# EAGLE design cc2652p_rf-star (EAGLE 9.6.2)
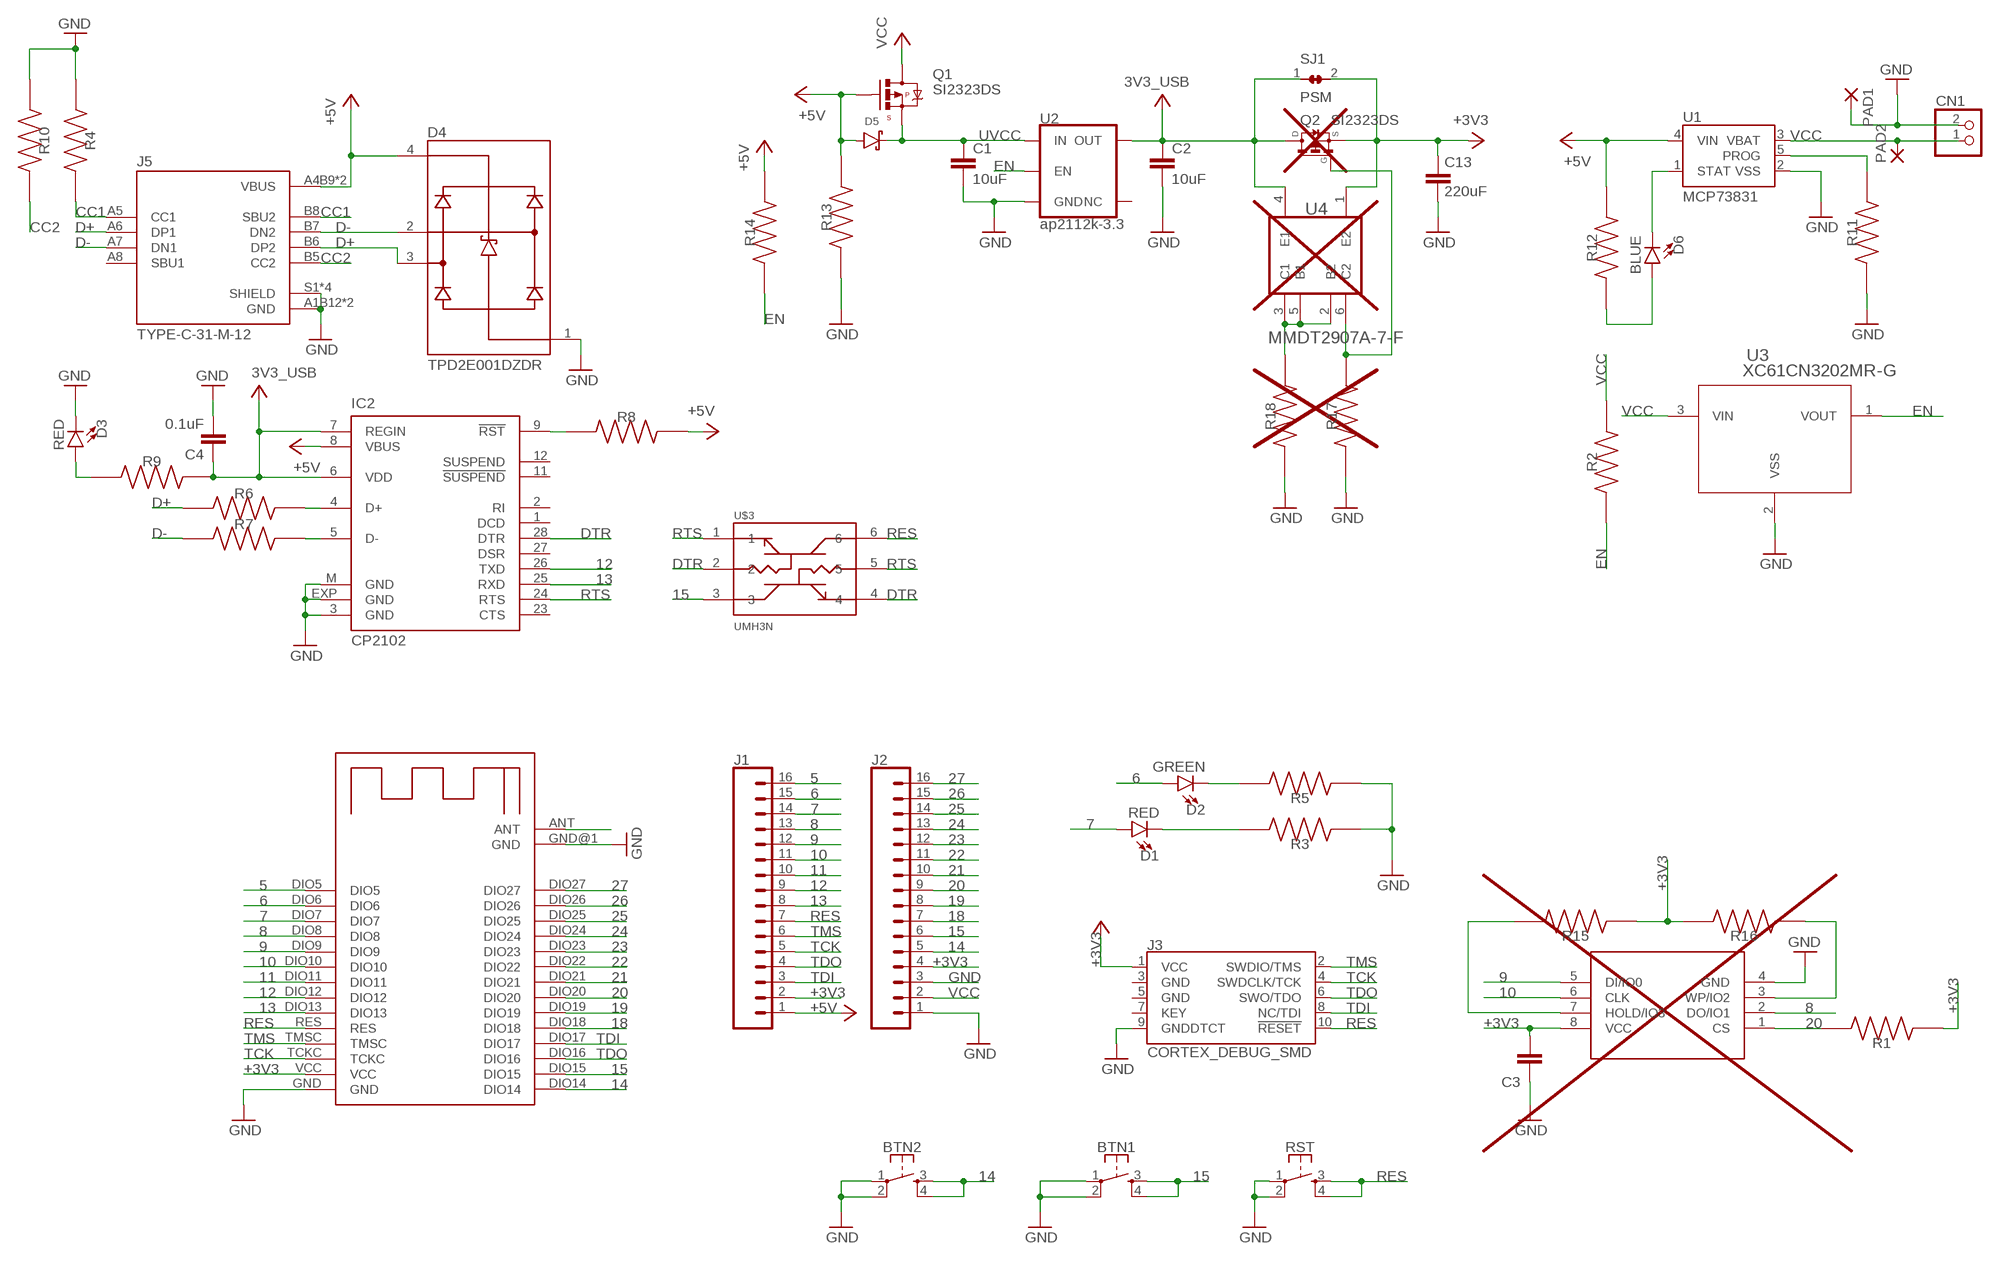
[diagram p0: schematic, sheet 1]

## Parts
BTN1  MOMENTARY-SWITCH-SPST-2-SMD-4.6X2.8MM  [TACTILE_SWITCH_SMD_4.6X2.8MM]
BTN2  MOMENTARY-SWITCH-SPST-2-SMD-4.6X2.8MM  [TACTILE_SWITCH_SMD_4.6X2.8MM]
C1  10uF  10UF-0603-6.3V-20%  [0603]
C2  10uF  10UF-0603-6.3V-20%  [0603]
C3  100n  CAP0402  [CAPC1005X40N]
C4  0.1uF  0.1UF-0603-25V-(+80/-20%)  [0603]
C13  220uF  C_TANTALUM-2917(7343-METRIC)  [CAPM7343X310]
CN1  JST_2PIN-SMT-RA  [JST-PH-2-SMT-RA]
D1  RED  LED-RED0603  [LED-0603]
D2  GREEN  LED-GREEN0603  [LED-0603]
D3  RED  LED-RED0603  [LED-0603]
D4  TPD2E001DZDR  [SOT192P237X122-4N]
D5  DIODE-SCHOTTKY  [SOD-323]
D6  BLUE  LED-BLUE0603  [LED-0603]
IC2  CP2102  [MLP28]
J1  CONN_161X16_NO_SILK  [1X16_NO_SILK]
J2  CONN_161X16_NO_SILK  [1X16_NO_SILK]
J3  CORTEX_DEBUG_SMD  [SAMTECH_FTSH-105-01]
J5  TYPE-C-31-M-12  [HRO_TYPE-C-31-M-12]
PAD1  WIREPADSMD1,27-254  [SMD1,27-2,54]
PAD2  WIREPADSMD1,27-254  [SMD1,27-2,54]
Q1  SI2323DS  MOSFET-PCHANNEL  [SOT23]
Q2  SI2323DS  [SOT23]
R1  2.2k  RC0402FR-073M6L  [RESC1005X40N]
R2  10k  RC0402FR-073M6L  [RESC1005X40N]
R3  2.2k  RC0402FR-073M6L  [RESC1005X40N]
R4  5.1k  RC0402FR-073M6L  [RESC1005X40N]
R5  2.2k  RC0402FR-073M6L  [RESC1005X40N]
R6  33Ohm  RC0402FR-073M6L  [RESC1005X40N]
R7  33Ohm  RC0402FR-073M6L  [RESC1005X40N]
R8  4.7k  RC0402FR-073M6L  [RESC1005X40N]
R9  2.2k  RC0402FR-073M6L  [RESC1005X40N]
R10  5.1k  RC0402FR-073M6L  [RESC1005X40N]
R11  2k  RC0402FR-073M6L  [RESC1005X40N]
R12  2.2k  RC0402FR-073M6L  [RESC1005X40N]
R13  100k  RC0402FR-073M6L  [RESC1005X40N]
R14  10k  RC0402FR-073M6L  [RESC1005X40N]
R15  0  RC0402FR-073M6L  [RESC1005X40N]
R16  0  RC0402FR-073M6L  [RESC1005X40N]
R17  100k  RC0402FR-073M6L  [RESC1005X40N]
R18  100k  RC0402FR-073M6L  [RESC1005X40N]
RST  MOMENTARY-SWITCH-SPST-2-SMD-4.6X2.8MM  [TACTILE_SWITCH_SMD_4.6X2.8MM]
SJ1  PSM  SMALL_SOLDER_JUMPER_CLOSED  [SMALL_SOLDER_JUMPER_CLOSED]
U1  MCP73831  [SOT23-5]
U2  ap2112k-3.3  V_REG_AP2112K-3.3V  [SOT23-5]
U3  XC61CN3202MR-G  [XC61C_SOT-23_TOR]
U4  MMDT2907A-7-F  [SOT65P210X110-6N]
U$1  MX25R8035FM1IL0  W25Q80BVSNIG  [SO-8]
U$2  RF-BM-2652P2  [RF-BM-2652P2]
U$3  UMH3N  [SOP65P210X100-6N]

## Nets
5: J1.16 U$2.DIO5
6: D2.A J1.15 U$2.DIO6
7: D1.A J1.14 U$2.DIO7
8: J1.13 U$1.2(DO/IO1) U$2.DIO8
9: J1.12 U$1.5(DI/IO0) U$2.DIO9
10: J1.11 U$1.6(CLK) U$2.DIO10
11: J1.10 U$2.DIO11
12: IC2.26(TXD) J1.9 U$2.DIO12
13: IC2.25(RXD) J1.8 U$2.DIO13
14: BTN2.3 BTN2.4 J2.5 U$2.DIO14
15: BTN1.3 BTN1.4 J2.6 U$2.DIO15 U$3.3
18: J2.7 U$2.DIO18
19: J2.8 U$2.DIO19
20: J2.9 R1.2 U$1.1(CS) U$2.DIO20
21: J2.10 U$2.DIO21
22: J2.11 U$2.DIO22
23: J2.12 U$2.DIO23
24: J2.13 U$2.DIO24
25: J2.14 U$2.DIO25
26: J2.15 U$2.DIO26
27: J2.16 U$2.DIO27
+3V3: C3.2 C13.1 J1.2 J2.4 J3.1(VCC) Q2.2(S) R1.1 R15.1 R16.2 SJ1.2 U4.1(E2) U$1.8(VCC) U$2.VCC
+5V: D4.4(VCC) D5.A IC2.8(VBUS) J1.1 J5.A4B9(VBUS) J5.B4A9(VBUS) Q1.1(G) R8.2 R12.2 R13.2 R14.2 U1.4(VIN)
CC1: J5.A5(CC1) J5.B8(SBU2) R4.2
CC2: J5.B5(CC2) R10.2
D+: D4.3(IO2) J5.A6(DP1) J5.B6(DP2) R6.1
D-: D4.2(IO1) J5.A7(DN1) J5.B7(DN2) R7.1
DTR: IC2.28(DTR) U$3.2 U$3.4
EN: R2.1 R14.1 U2.3(EN) U3.1(VOUT)
GND: BTN1.1 BTN1.2 BTN2.1 BTN2.2 C1.2 C2.2 C3.1 C4.2 C13.2 CN1.2 D3.C D4.1(GND) IC2.3(GND) IC2.EXP(GND) IC2.M(GND) J2.1 J2.3 J3.9(GNDDTCT) J5.A1B12(GND) J5.B1A12(GND) J5.S1(SHIELD) J5.S2(SHIELD) J5.S3(SHIELD) J5.S4(SHIELD) PAD1.1(P) R3.1 R4.1 R5.1 R10.1 R11.1 R13.1 R17.1 R18.1 RST.1 RST.2 U1.2(VSS) U2.2(GND) U3.2(VSS) U$1.4(GND) U$2.GND U$2.GND@1(GND)
N$1: IC2.9(!RST) R8.1
N$2: D1.C R3.2
N$3: D2.C R5.2
N$5: IC2.4(D+) R6.2
N$6: IC2.5(D-) R7.2
N$7: D3.A R9.2
N$8: R11.2 U1.5(PROG)
N$9: D6.A R12.1
N$10: R18.2 U4.2(B2) U4.3(C1) U4.5(B1)
N$11: D6.C U1.1(STAT)
N$12: R15.2 U$1.7(HOLD/IO3)
N$13: Q2.1(G) R17.2 U4.6(C2)
N$15: R16.1 U$1.3(WP/IO2)
N$24: U$2.ANT
RES: J1.7 J3.10(!RESET) RST.3 RST.4 U$2.RES U$3.6
RTS: IC2.24(RTS) U$3.1 U$3.5
TCK: J1.5 J3.4(SWDCLK/TCK) U$2.TCKC
TDI: J1.3 J3.8(NC/TDI) U$2.DIO17
TDO: J1.4 J3.6(SWO/TDO) U$2.DIO16
TMS: J1.6 J3.2(SWDIO/TMS) U$2.TMSC
UVCC: C1.1 D5.C Q1.2(S) U2.1(IN)
V+: C2.1 C4.1 IC2.6(VDD) IC2.7(REGIN) Q2.3(D) R9.1 SJ1.1 U2.5(OUT) U4.4(E1) ; supply symbol labelled 3V3_USB
VCC: CN1.1 J2.2 PAD2.1(P) Q1.3(D) R2.2 U1.3(VBAT) U3.3(VIN)
Unconnected: IC2.1(DCD) IC2.2(RI) IC2.11(!SUSPEND) IC2.12(SUSPEND) IC2.23(CTS) IC2.27(DSR) J3.3(GND) J3.5(GND) J3.7(KEY) J5.A8(SBU1) U2.4(NC)

## Library data of the parts
BTN1 BTN2 RST = SparkFun-Switches:MOMENTARY-SWITCH-SPST-2: Momentary Switch (Pushbutton) - SPST - Two Circuits Normally-open (NO) SPST momentary switches (buttons, pushbuttons). Schematic symbol includes two switch circuits. Variants SMD-4.6MMX2.8MM - 4.60mm x 2.80mm Tactile Momentary Button Switch - Used on SparkFun SAMD21 Mini Breakout <https://www.sparkfun.com/products/13664> SMD-5.2MM - Mini Pushbutton Switch - SMD <https://www.sparkfun.com/products/8720> - Used on Arduino Pro Mini <https://www.sparkfun.com/products/11114>; PROD_ID: SWCH-13065
C1 C2 = SparkFun-Capacitors:10UF: 10.0µF ceramic capacitors A capacitor is a passive two-terminal electrical component used to store electrical energy temporarily in an electric field.; PROD_ID: CAP-11015
C3 = discretes-dev:CAP0402: CAP, 0402; AVAILABILITY: Good; DESCRIPTION: RESISTOR, 0402 0.063W 1% 3M6; Resistance:3.6Mohm; Resistance Tolerance:± 1%; Power Rating:0.063W; Voltage Rating:50V; Series:RC32H; Temperature Coefficient:± 100ppm/°C; Resistor Element Type:Thick Film; Resistor Case Style:0402; No. of Pins:2; SVHC:No SVHC; Case Style:0402; External Length / Height:1mm; Temperature Coeff. +:100ppm/°C; Temperature Coeff. -:100ppm/°C; External Depth:0.35mm; External Width:0.5mm; Operating Temperature Range:-55°C to +155°C; Overload Voltage:100V; MF: Yageo; MP: RC0402FR-073M6L; PACKAGE: 1005 Panasonic Electronic Components; PRICE: None; PURCHASE-URL: https://pricing.snapeda.com/search/part/RC0402FR-073M6L/?ref=eda
C4 = SparkFun-Capacitors:0.1UF: 0.1µF ceramic capacitors A capacitor is a passive two-terminal electrical component used to store electrical energy temporarily in an electric field.; PROD_ID: CAP-00810
C13 = Capacitor:C: Capacitor - Generic; CATEGORY: Capacitor
CN1 = adafruit:JST_2PIN: JST 2-Pin Connectors of various flavors SMT-RA (S2B-PH-SM4) 4UConnector #17311 SMT (B2B-PH-SM4) THM-RA (S2B-PH) THM (B2B-PH)
D1 D3 = SparkFun-LED:LED-RED: Red SMD LED Used in manufacturing of most products at SparkFun Packages: 0603 - SMD 0603 package [Product Link] <http://docs.avagotech.com/docs/AV02-0551EN> 0603 SMART - SMD 0603 SMART package ( more efficient and expensive)[Product Link] <http://www.osram-os.com/Graphics/XPic2/00077099_0.pdf> 1206 - SMD1206 package [Product Link] <https://www.sparkfun.com/datasheets/DevTools/LilyPad/Q150OVS4.pdff> SparkFun Products: Pro Mini 328 -5V <https://www.sparkfun.com/products/821> RedBoard <https://www.sparkfun.com/products/12757> IOIO-OTG <https://www.sparkfun.com/products/13613>; PROD_ID: DIO-00819
D2 = SparkFun-LED:LED-GREEN: Green SMD LED Used in manufacturing of various products at SparkFun Packages: 0603 - SMD 0603 package [Product Link] <http://www.futureelectronics.com/en/technologies/semiconductors/optoelectronics/leds/Pages/9894312-LTST-C190GKT.aspx?CrossPart=HSMG-C190&IM=0> LilyPad 1206 - SMD1206 LilyPad package [Product Link] <http://www.futureelectronics.com/en/Technologies/Product.aspx?ProductID=IN150NGHARVATEKCORPORATION2049943&IM=0> 1206 - SMD1206 package [Product Link] <http://www.futureelectronics.com/en/technologies/semiconductors/optoelectronics/leds/Pages/8315665-LTST-C150KGKT.aspx?IM=0> 1206 Bottom Mount -SMD 1206 Bottom Mount [Product Link] <http://www.digikey.com/product-detail/en/lite-on-inc/LTST-C230KGKT/160-1456-1-ND/386854> SparkFun Products: Pro Mini 328 -5V <https://www.sparkfun.com/products/821> RedBoard <https://www.sparkfun.com/products/12757> MP3 Trigger <https://www.sparkfun.com/products/13720> Makey Makey <https://www.sparkfun.com/products/11076>; PROD_ID: DIO-00821
D4 = TPD2E001DZDR:TPD2E001DZDR: Low-capacitance 2-channel +/-15k-V ESD protection array for high-speed data interfaces Check prices <https://pricing.snapeda.com/parts/TPD2E001DZDR/Texas%20Instruments/view-part?ref=eda>; AVAILABILITY: In Stock; DESCRIPTION: Low-capacitance 2-channel +/-15k-V ESD protection array for high-speed data interfaces 4-SOT-23 -40 to 85; MF: Texas Instruments; MP: TPD2E001DZDR; PACKAGE: SOT-23-4 Texas Instruments; PRICE: None; PURCHASE-URL: https://pricing.snapeda.com/search/part/TPD2E001DZDR/?ref=eda
D5 = pimoroni-passives:DIODE-SCHOTTKY
D6 = SparkFun-LED:LED-BLUE: Blue SMD LED Used in manufacturing of various products at SparkFun Packages: 0603 - SMD 0603 package [Product Link] <http://www.digikey.com/product-detail/en/SMLE12BC7TT86/511-1589-2-ND/1641808> 1206 - SMD1206 package [Product Link] <http://www.digikey.com/product-detail/en/lite-on-inc/LTST-C150TBKT/160-1643-1-ND/573584> SparkFun Products: ESP8266 Thing-Dev Board <https://www.sparkfun.com/products/13711> RedBoard <https://www.sparkfun.com/products/12757>; PROD_ID: DIO-08575
IC2 = silabs:CP210*: Single-Chip USB to UART Bridge Source: www.silabs.com .. CP2101.pdf / cp2102.pdf; MF: FARNELL; MPN: CP2102-GM; OC_FARNELL: 9282130; OC_NEWARK: 30K5635
J1 J2 = SparkFun-Connectors:CONN_16: Multi connection point. Often used as Generic Header-pin footprint for 0.1 inch spaced/style header connections On any of the 0.1 inch spaced packages, you can populate with these: Break Away Headers - Straight <https://www.sparkfun.com/products/116> (PRT-00116) Break Away Male Headers - Right Angle <https://www.sparkfun.com/products/553> (PRT-00553) Female Headers <https://www.sparkfun.com/products/115> (PRT-00115) Break Away Headers - Machine Pin <https://www.sparkfun.com/products/117> (PRT-00117) Break Away Female Headers - Swiss Machine Pin <https://www.sparkfun.com/products/743> (PRT-00743) For SCREWTERMINALS and SPRING TERMINALS visit here: Screw Terimnals on SparkFun.com <https://www.sparkfun.com/search/results?term=Screw+Terminals> (5mm/3.5mm/2.54mm spacing) This device is also useful as a general connection point to wire up your design to another part of your project. Our various solder wires solder well into these plated through hole pads. Hook-Up Wire - Assortment (Stranded, 22 AWG) <https://www.sparkfun.com/products/11375> (PRT-11375) Hook-Up Wire - Assortment (Solid Core, 22 AWG) <https://www.sparkfun.com/products/11367> (PRT-11367) View the entire wire category on our website here <https://www.sparkfun.com/categories/141> Special notes: Molex polarized connector foot print use with SKU : PRT-08231 with associated crimp pins and housings. 1MM SMD Version SKU: PRT-10208 NOTES ON THE VARIANTS LOCK and LOCK_LONGPADS... This footprint was designed to help hold the alignment of a through-hole component (i.e. 6-pin header) while soldering it into place. You may notice that each hole has been shifted either up or down by 0.005 of an inch from it's more standard position (which is a perfectly straight line). This slight alteration caused the pins (the squares in the middle) to touch the edges of the holes. Because they are alternating, it causes a "brace" to hold the component in place. 0.005 has proven to be the perfect amount of "off-center" position when using our standard breakaway headers. Although looks a little odd when you look at the bare footprint, once you have a header in there, the alteration is very hard to notice. Also,if you push a header all the way into place, it is covered up entirely on the bottom side.
J3 = SparkFun-Connectors:CORTEX_DEBUG: Cortex Debug Connector - 10 pin Supports JTAG debug, Serial Wire debug, and Serial Wire Viewer. PTH and SMD connector options available. General Connector Information <http://infocenter.arm.com/help/topic/com.arm.doc.faqs/attached/13634/cortex_debug_connectors.pdf> Products: PTH Connector <http://www.digikey.com/product-detail/en/cnc-tech/3220-10-0100-00/1175-1627-ND/3883661> -via Digi-Key SparkFun PSoc <https://www.sparkfun.com/products/13229> SparkFun T <https://www.sparkfun.com/products/13810>
J5 = TYPE-C-31-M-12:TYPE-C-31-M-12: USB Connectors 24 Receptacle 1 8.94*7.3mm RoHS; AVAILABILITY: Unavailable; DESCRIPTION: USB Connectors 24 Receptacle 1 8.94*7.3mm RoHS; MF: HRO Electronics Co., Ltd.; MP: TYPE-C-31-M-12; PACKAGE: Package; PRICE: None
PAD1 PAD2 = wirepad:WIREPAD: Wire PAD connect wire on PCB
Q1 = pimoroni-passives:MOSFET-PCHANNEL: Generic PMOSFET
Q2 = SI2323DS:SI2323DS: P-Channel MOSFET; AVAILABILITY: Unavailable; DESCRIPTION: P-Channel 20V 3.7A (Ta) 750mW (Ta) Surface Mount SOT-23-3 (TO-236); MF: Vishay Siliconix; MP: SI2323DS; PACKAGE: SOT-23-3 Vishay Siliconix; PRICE: None
R1-R18 = RC0402FR-073M6L:RC0402FR-073M6L: RESISTOR, 0402 0.063W 1% 3M6; Resistance:3.6Mohm; Resistance Tolerance:± 1%; Power Rating:0.063W; Voltage Rating:50V; Series:RC32H; Temperature Coefficient:± 100ppm/°C; Resistor Element Type:Thick Film; Resistor Case Style:0402; No. of Pins:2; SVHC:No SVHC; Case Style:0402; External Length / Height:1mm; Temperature Coeff. +:100ppm/°C; Temperature Coeff. -:100ppm/°C; External Depth:0.35mm; External Width:0.5mm; Operating Temperature Range:-55°C to +155°C; Overload Voltage:100V Check prices <https://pricing.snapeda.com/parts/RC0402FR-073M6L/Yageo/view-part?ref=eda>; AVAILABILITY: Good; DESCRIPTION: RESISTOR, 0402 0.063W 1% 3M6; Resistance:3.6Mohm; Resistance Tolerance:± 1%; Power Rating:0.063W; Voltage Rating:50V; Series:RC32H; Temperature Coefficient:± 100ppm/°C; Resistor Element Type:Thick Film; Resistor Case Style:0402; No. of Pins:2; SVHC:No SVHC; Case Style:0402; External Length / Height:1mm; Temperature Coeff. +:100ppm/°C; Temperature Coeff. -:100ppm/°C; External Depth:0.35mm; External Width:0.5mm; Operating Temperature Range:-55°C to +155°C; Overload Voltage:100V; MF: Yageo; MP: RC0402FR-073M6L; PACKAGE: 1005 Panasonic Electronic Components; PRICE: None; PURCHASE-URL: https://pricing.snapeda.com/search/part/RC0402FR-073M6L/?ref=eda
SJ1 = pimoroni-misc:SMALL_SOLDER_JUMPER_CLOSED
U1 = SparkFun-IC-Power:MCP73831: MCP73831T Li-Ion, Li-Pol Controller Miniature single cell, fully integrated Li-Ion, Li-polymer charge management controller Datasheet <http://ww1.microchip.com/downloads/en/DeviceDoc/20001984g.pdf> SparkFun Products: SparkFun ESP32 Thing <https://www.sparkfun.com/products/13907> SparkFun 9DoF Razor IMU M0 <https://www.sparkfun.com/products/14001>; PROD_ID: IC-09995
U2 = SparkFun-IC-Power:V_REG_AP2112: AP2112 - 600mA CMOS LDO Regulator w/ Enable The AP2112 is CMOS process low dropout linear regulator with enable function, the regulator delivers a guaranteed 600mA (min.) continuous load current. Features Output Voltage Accuracy: ±1.5% Output Current: 600mA (Min.) Foldback Short Current Protection: 50mA Enable Function to Turn ON/OFF VOUT Low Dropout Voltage (3.3V): 250mV (Typ.) @IOUT=600mA Excellent Load Regulation: 0.2%/A (Typ.) Excellent Line Regulation: 0.02%/V (Typ.) Low Quiescent Current: 55μA (Typ.) Low Standby Current: 0.01μA (Typ.) Low Output Noise: 50μVRMS PSRR: 100Hz -65dB, 1kHz -65dB OTSD Protection Stable with 1.0μF Flexible Cap: Ceramic, Tantalum and Aluminum Electrolytic Operation Temperature Range: -40°C to 85°C ESD: MM 400V, HBM 4000V; PROD_ID: VREG-12457; VALUE: 3.3V
U3 = XC61CN3202MRG:XC61CN3202MR-G; BUILT_BY: EMA_UL_Team; MANUFACTURER_PART_NUMBER: XC61CN3202MR-G; SOURCELIBRARY: Torex_2016-06-30_2; VENDOR: Torex Semiconductor
U4 = MMDT2907A-7-F:MMDT2907A-7-F: DUAL PNP SMALL SIGNAL SURFACE MOUNT TRANSISTOR Check availability <https://pricing.snapeda.com/parts/MMDT2907A-7-F/Diodes%20Inc./view-part?ref=eda>; AVAILABILITY: In Stock; DESCRIPTION: Bipolar (BJT) Transistor Array 2 PNP (Dual) 60V 600mA 200MHz 200mW Surface Mount SOT-363; MF: Diodes Inc.; MP: MMDT2907A-7-F; PACKAGE: SOT-363 Diodes Inc.; PRICE: None; PURCHASE-URL: https://pricing.snapeda.com/search/part/MMDT2907A-7-F/?ref=eda
U$1 = W25Q80BVSNIG:W25Q80BVSNIG: Check availability <https://pricing.snapeda.com/parts/W25Q80BVSNIG/Winbond%20Electronics/view-part?ref=eda>; AVAILABILITY: In Stock; DESCRIPTION: FLASH - NOR Memory IC 8Mb (1M x 8) SPI - Quad I/O 104 MHz 8-SOIC; MF: Winbond Electronics; MP: W25Q80BVSNIG; PACKAGE: SOIC-8 Winbond; PRICE: None
U$2 = E72-2G4M20S1E:RF-BM-2652P2
U$3 = UMH3N:UMH3N: Dual PNP/NPN transistor for chip reset; AVAILABILITY: Unavailable; DESCRIPTION: Pre-Biased Bipolar Transistor (BJT) 2 NPN - Pre-Biased (Dual) 50V 100mA 250MHz 150mW Surface Mount UMT6; MF: Rohm; MP: UMH3N; PACKAGE: SOT-363 Rohm; PRICE: None

## Board
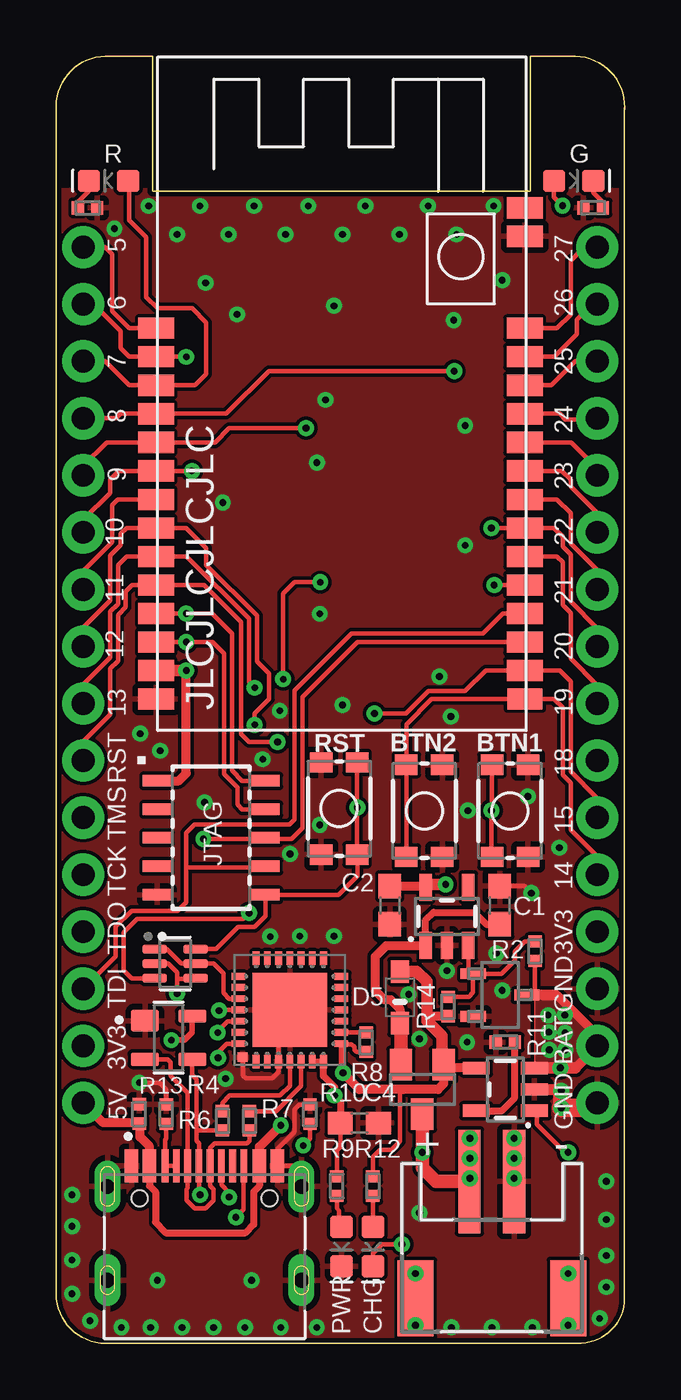
[diagram p1: board, top side]
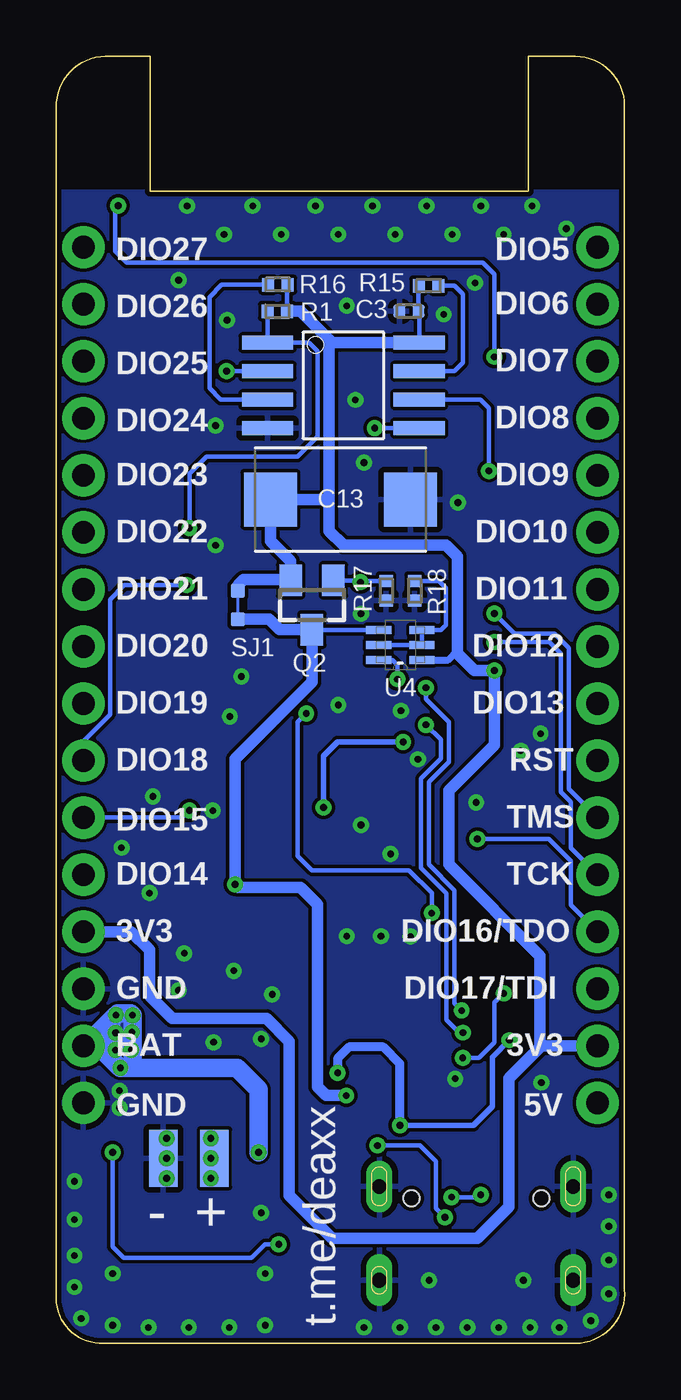
[diagram p2: board, bottom side, seen from below]

Size 25.32 x 57.31 mm. Coordinates in mm from the lower left corner, seen from the top.
Outline: 2.31,0.01 2.41,0.01
Outline: 2.41,0.01 23.21,0.01 arc87 25.31,1.81 25.31,54.81
Outline: 2.31,57.31 2.41,57.31
Outline: 2.41,57.31 arc87 0.01,55.31 0.01,2.41 arc100 2.41,0.01
Outline: 2.41,57.31 4.29,57.31 4.29,51.31 21.13,51.31 21.13,57.31 22.91,57.31
Outline: 22.91,57.31 23.01,57.31
Outline: 25.31,55.01 25.31,54.81
Outline: 22.91,57.31 arc-100 25.31,54.81
Copper layers (1*16): Top 0.035mm / dielectric 1.5mm / Bottom 0.035mm
Design rules "default *": minimum track width 0.2mm, minimum drill 0.3mm, track to track 6mil, track to pad 6mil, pad to pad 6mil, via to via 6mil, smd to smd 6mil, copper to edge 0.2mm, drill to drill 0.3mm, minimum pad ring 10mil, minimum via ring 8mil, stop-mask expansion 2mil, vias tented up to drill 0.3mm, thermal gap 10mil
bRestrict: area 16.8,32.6 to 17.7,33.2

### Footprints (pad centres in the part's own frame; a part is rotated, then mirrored left to right if it is on the bottom)
TACTILE_SWITCH_SMD_4.6X2.8MM = smd 0.9 x 1: 1 -2.05,-0.8; 2 2.05,-0.8; 3 2.05,0.8; 4 -2.05,0.8
0603 = smd 1.1 x 1: 1 -0.85,0; 2 0.85,0
CAPC1005X40N = smd 0.54 x 0.6: 1 -0.432,0; 2 0.432,0
CAPM7343X310 = smd 2.368 x 2.404: 1 -3.121,0; 2 3.121,0
JST-PH-2-SMT-RA = smd 1 x 4.6: 1 1,-3.7; 2 -1,-3.7 | smd 1.6 x 3.4: NC1 -3.4,1.5; NC2 3.4,1.5
LED-0603 = smd 1 x 1: A -0.877,0; C 0.877,0
SOT192P237X122-4N = smd 1.24 x 0.99: 1 -1.055,0.76 | smd 1.24 x 0.59: 2 -1.055,-0.96; 3 1.055,-0.96; 4 1.055,0.96
SOD-323 = smd 1 x 0.8: A 1.15,0; C -1.15,0
MLP28 = smd 0.6 x 0.3: 1 -2.3,1.5; 2 -2.3,1; 3 -2.3,0.5; 4 -2.3,0; 5 -2.3,-0.5; 6 -2.3,-1; 7 -2.3,-1.5; 15 2.3,-1.5; 16 2.3,-1; 17 2.3,-0.5; 18 2.3,0; 19 2.3,0.5; 20 2.3,1; 21 2.3,1.5 | smd 0.3 x 0.6: 8 -1.5,-2.3; 9 -1,-2.3; 10 -0.5,-2.3; 11 0,-2.3; 12 0.5,-2.3; 13 1,-2.3; 14 1.5,-2.3; 22 1.5,2.3; 23 1,2.3; 24 0.5,2.3; 25 0,2.3; 26 -0.5,2.3; 27 -1,2.3; 28 -1.5,2.3 | smd 3.3 x 3.3: EXP 0,0 | smd 0.435 x 0.435: M -2.103,2.103
1X16_NO_SILK = drill 1.016 pad 1.88: 1 0,0; 2 2.54,0; 3 5.08,0; 4 7.62,0; 5 10.16,0; 6 12.7,0; 7 15.24,0; 8 17.78,0; 9 20.32,0; 10 22.86,0; 11 25.4,0; 12 27.94,0; 13 30.48,0; 14 33.02,0; 15 35.56,0; 16 38.1,0
SAMTECH_FTSH-105-01 = smd 0.508 x 1.27: 1 -2.54,-2.413; 2 -2.54,2.413; 3 -1.27,-2.413; 4 -1.27,2.413; 5 0,-2.413; 6 0,2.413; 7 1.27,-2.413; 8 1.27,2.413; 9 2.54,-2.413; 10 2.54,2.413
HRO_TYPE-C-31-M-12 = smd 0.6 x 1.45: A1B12 -3.25,5.095; A4B9 -2.45,5.095; B1A12 3.25,5.095; B4A9 2.45,5.095 | smd 0.3 x 1.45: A5 -1.25,5.095; A6 -0.25,5.095; A7 0.25,5.095; A8 1.25,5.095; B5 1.75,5.095; B6 0.75,5.095; B7 -0.75,5.095; B8 -1.75,5.095 | drill 0.65 pad 1.05 long: S1 -4.32,4.18; S2 4.32,4.18; S3 -4.32,0; S4 4.32,0 | hole 0.7: -2.89,3.65; 2.89,3.65
SMD1,27-2,54 = smd 1.27 x 2.54: 1 0,0
SOT23 = smd 1 x 1.4: 1 -0.95,-1.1; 2 0.95,-1.1; 3 0,1.1
RESC1005X40N = smd 0.54 x 0.6: 1 -0.432,0; 2 0.432,0
SMALL_SOLDER_JUMPER_CLOSED = smd 0.635 x 0.635: 1 -0.635,0; 2 0.635,0
SOT23-5 = smd 0.55 x 1.2: 1 -0.95,-1.3; 2 0,-1.3; 3 0.95,-1.3; 4 0.95,1.3; 5 -0.95,1.3
XC61C_SOT-23_TOR = smd 0.483 x 1.118: 1 -0.95,-1.194; 2 0.95,-1.194; 3 0,1.194
SOT65P210X110-6N = smd 1.118 x 0.356: 1 -0.965,0.66; 2 -0.965,0; 3 -0.965,-0.66; 4 0.965,-0.66; 5 0.965,0; 6 0.965,0.66
SO-8 = smd 2.286 x 0.61: 1 -3.378,1.27; 2 -3.378,0; 3 -3.378,-1.27; 4 -3.378,-2.54; 5 3.378,-2.54; 6 3.378,-1.27; 7 3.378,0; 8 3.378,1.27
RF-BM-2652P2 = smd 1.6 x 0.94: ANT 16.346,23.27; DIO5 -0.073,17.91; DIO6 -0.073,16.64; DIO7 -0.073,15.37; DIO8 -0.073,14.1; DIO9 -0.073,12.83; DIO10 -0.073,11.56; DIO11 -0.073,10.29; DIO12 -0.073,9.02; DIO13 -0.073,7.75; DIO14 16.346,1.4; DIO15 16.346,2.67; DIO16 16.346,3.94; DIO17 16.346,5.21; DIO18 16.346,6.48; DIO19 16.346,7.75; DIO20 16.346,9.02; DIO21 16.346,10.29; DIO22 16.346,11.56; DIO23 16.346,12.83; DIO24 16.346,14.1; DIO25 16.346,15.37; DIO26 16.346,16.64; DIO27 16.346,17.91; GND -0.073,1.4; GND@1 16.346,22; RES -0.073,6.48; TCKC -0.073,3.94; TMSC -0.073,5.21; VCC -0.073,2.67
SOP65P210X100-6N = smd 1.09 x 0.4: 1 -0.92,0.65; 2 -0.92,0; 3 -0.92,-0.65; 4 0.92,-0.65; 5 0.92,0; 6 0.92,0.65

### Placement (x,y rotation side)
BTN1  20.22,23.71 90 top
BTN2  16.4,23.71 90 top
C1  19.76,19.51 90 top
C2  14.86,19.51 270 top
C3  9.61,45.96 0 bottom
C4  13.51,9.81 0 top
C13  12.66,37.57 0 bottom
CN1  19.41,3.51 180 top
D1  2.34,51.76 180 top
D2  23.06,51.76 0 top
D3  12.71,4.31 270 top
D4  5.01,13.61 0 top
D5  15.31,15.41 90 top
D6  14.11,4.31 270 top
IC2  10.41,14.84 90 top
J1  1.21,10.71 90 top
J2  24.11,10.71 90 top
J3  6.91,22.51 270 top
J5  6.61,2.81 0 top
PAD1  20.55,8.23 0 bottom
PAD2  18.27,8.24 0 bottom
Q1  16.31,11.31 180 top
Q2  13.93,32.88 180 bottom
R1  15.47,45.96 180 bottom
R2  21.33,17.46 270 top
R3  1.4,50.56 180 top
R4  4.91,10.21 270 top
R5  23.92,50.56 0 top
R6  7.41,9.91 90 top
R7  8.61,9.91 90 top
R8  13.81,13.41 270 top
R9  12.51,7.01 270 top
R10  11.31,10.21 270 top
R11  20.01,13.41 0 top
R12  14.11,7.01 90 top
R13  3.7,10.22 270 top
R14  17.46,15 270 top
R15  8.73,47.09 0 bottom
R16  15.45,47.14 0 bottom
R17  10.62,33.51 90 bottom
R18  9.35,33.51 90 bottom
RST  12.61,23.81 270 top
SJ1  17.23,32.88 90 bottom
U1  20.01,11.31 90 top
U2  17.41,19.01 0 top
U3  19.77,15.51 270 top
U4  9.99,31.1 180 bottom
U$1  12.53,43.29 0 bottom
U$2  4.53,27.29 0 top
U$3  5.3,16.91 0 top

### Tracks (layer width: path | path; a pad name or v marks a point on that pad's centre or on a via)
5
  Top 0.2: J1.16 2.18,48.81 2.5,48.5 2.5,45.96 3.25,45.2 U$2.DIO5
6  (via drill 0.3)
  Top 0.2: J1.15 1.68,46.27 2.88,45.08 2.88,44.31 3.25,43.93 U$2.DIO6 v5.79,43.93 v5.8,43.92 | D2.A 22.18,51.04 v22.56,50.66
  Bottom 0.2: v22.56,50.66 22.69,50.53 22.69,48.62 22.18,48.12 6.31,48.12 5.8,47.61 v5.8,43.92
7
  Top 0.2: 4.32,42.65 U$2.DIO7 | J1.14 2.18,43.73 3.25,42.66 4.02,42.66 | 4.02,42.66 U$2.DIO7 | 4.02,42.65 4.02,42.66 | U$2.DIO7 6.18,42.66 6.69,43.16 6.69,45.45 6.05,46.08 4.53,46.08 4.02,46.59 4.02,49.26 3.26,50.02 3.26,51.72 D1.A
8  (via drill 0.3)
  Top 0.2: J1.13 2.68,41.19 2.88,41.39 U$2.DIO8 7.58,41.39 9.48,43.29 v17.74,43.29
  Bottom 0.2: U$1.2 v17.74,43.29
9  (via drill 0.3)
  Top 0.2: J1.12 1.21,39.08 2.24,40.12 U$2.DIO9 7.07,40.12 7.7,40.75 v11.13,40.75
  Bottom 0.2: U$1.5 v11.13,40.75
10  (via drill 0.3)
  Top 0.2: J1.11 1.21,36.67 2.4,37.86 2.4,38.46 2.79,38.85 U$2.DIO10 v6.05,38.85 v6.05,38.84
  Bottom 0.2: v6.05,38.84 6.05,41.64 6.43,42.02 U$1.6
11
  Top 0.2: J1.10 1.21,34.38 2.5,35.67 2.5,37.32 2.75,37.58 U$2.DIO11
12  (via drill 0.3)
  Top 0.2: J1.9 1.21,31.88 2.4,33.08 2.4,35.08 2.88,35.55 2.88,36.05 3.13,36.31 U$2.DIO12 5.79,36.31 6.69,35.42 6.69,34.66 8.94,32.41 8.94,30.37 9.48,29.83 9.48,28.68 8.85,28.05 v8.85,27.54 | v7.2,13.84 7.2,13.9 7.65,14.34 IC2.26
  Bottom 0.2: v8.85,27.54 8.18,26.88 8.18,26.04 9.07,25.15 9.07,21.17 7.93,20.03 7.93,14.39 7.37,13.84 v7.2,13.84
13  (via drill 0.3)
  Top 0.2: J1.8 1.21,29.34 2.4,30.54 2.4,32.58 2.75,32.93 2.75,34.65 3.14,35.04 U$2.DIO13 5.81,35.04 8.59,32.26 8.59,29.45 v8.85,29.19 | IC2.25 7.47,14.84 7.45,14.82 v7.26,14.82
  Bottom 0.2: v7.26,14.82 7.58,15.13 7.58,20.18 8.72,21.32 8.72,25 7.83,25.89 7.83,27.67 8.85,28.68 v8.85,29.19
14
  Top 0.2: J2.5 24.11,21.68 22.92,22.87 22.92,24.96 22.56,25.31 22.56,28.3 22.18,28.69 U$2.DIO14 16.72,28.69 15.6,27.56 BTN2.3 BTN2.4
15  (via drill 0.3)
  Top 0.2: J2.6 24.11,24.26 22.92,25.46 22.92,29.47 22.43,29.96 21.16,29.96 U$2.DIO15 19.14,29.96 18.22,29.04 16.58,29.04 15.59,28.05 v14.18,28.05 | U$3.3 3.36,16.26 3.01,16.61 3.01,18.3 3.61,18.91 8.34,18.91 v8.59,19.16 | BTN1.3 19.42,23.76 v19.39,23.73 19.39,21.69 BTN1.4
  Bottom 0.2: v8.59,19.16 8.59,20.05 9.61,21.06 13.93,21.06 14.56,21.7 14.56,27.67 v14.18,28.05 | v19.39,23.73 19.71,23.41 J2.6
18  (via drill 0.3)
  Top 0.2: U$2.DIO18 21.12,33.76 v19.51,33.76
  Bottom 0.2: v19.51,33.76 22.28,33.76 22.92,33.13 22.92,28 24.11,26.8 J2.7
19
  Top 0.2: U$2.DIO19 22.31,35.04 22.56,34.78 22.56,32.88 22.92,32.53 22.92,30.49 24.11,29.3 J2.8
20  (via drill 0.3)
  Top 0.2: J2.9 24.11,31.84 22.92,33.03 22.92,35.12 22.56,35.47 22.56,35.92 22.18,36.31 U$2.DIO20 v19.39,36.3
  Bottom 0.2: R1.2 U$1.1 14.05,44.56 13.67,44.18 13.67,40.37 14.56,39.48 18.62,39.48 19.39,38.72 v19.39,36.3
21
  Top 0.2: U$2.DIO21 22.3,37.58 22.92,36.96 22.92,35.62 24.11,34.42 J2.10
22
  Top 0.2: U$2.DIO22 22.53,38.85 22.92,38.46 22.92,38.16 24.11,36.96 J2.11
23
  Top 0.2: U$2.DIO23 22.94,40.12 24.11,38.95 J2.12
24
  Top 0.2: U$2.DIO24 22.43,41.39 22.69,41.13 24.05,41.13 J2.13
25
  Top 0.2: U$2.DIO25 22.06,42.66 23.13,43.73 J2.14
26
  Top 0.2: U$2.DIO26 22.18,43.93 23.2,44.94 23.2,45.58 23.89,46.27 J2.15
27
  Top 0.2: U$2.DIO27 22.31,45.2 22.92,45.8 22.92,48.22 23.51,48.81 J2.16
+3V3  (via drill 0.3)
  Top 0.2: J3.1 4.54,25.01
  Top 0.406: J3.1 5.46,25.05 5.8,25.38 v5.8,29.95 v5.79,29.96
  Top 0.508: U$2.VCC v5.79,29.96
  Bottom 0.2: R15.1 C3.2 9.15,45.93 U$1.8 | R1.1 15.04,47.12 | 15.04,47.12 R16.2 | 15.01,47.09 15.04,47.12
  Bottom 0.305: U4.1 7.85,30.44 7.45,30.84
  Bottom 0.508: J1.2 3.71,13.25 | 3.71,13.25 5.16,11.79 5.16,6.08 6.56,4.68 13.04,4.68 14.94,6.58 14.94,13.44 15.96,14.46 20.15,14.46 21.16,15.48 21.16,17.51 21.99,18.33 J2.4 | 13.04,44.56 14.43,45.96 R1.1 | U$1.8 13.04,44.56 | 13.04,44.56 13.16,44.43 13.16,37.7 | 13.16,37.7 13.29,37.57 C13.1 15.78,35.72 14.88,34.82 Q2.2 14.92,34.02 16.97,34.02 17.23,33.76 SJ1.2 | 13.16,37.7 13.16,36.18 12.53,35.54 7.96,35.54 7.45,35.03 7.45,30.84 7.45,30.72 6.69,29.95 v5.8,29.95 5.8,26.65 7.83,24.62 7.83,21.32 3.77,17.25 3.77,13.31 3.71,13.25
+5V  (via drill 0.3)
  Top 0.2: D4.4 | 4.21,7.95 J5.A4B9 | 3.75,9.74 R13.2 | 16.56,14.57 16.51,14.62 | U1.4 17.41,12.26 | 13.79,13 R8.2 13.38,12.98 13.29,13.06 13.29,13.19 13.16,13.32 12.71,13.32 | R12.2 14.11,8.29 14.43,8.62 14.94,8.62 15.32,9 15.32,11.18 15.45,11.31
  Top 0.254: 6.07,14.57 D4.4 | v5.14,13.5 5.73,13.5 6.06,13.84 D4.4 | IC2.8 12.71,13.32 12.71,12.12 v12.78,12.05
  Top 0.305: J5.A4B9 4.16,7.01 4.42,6.75 4.42,5.4 4.91,4.91 8.41,4.91 8.8,5.3 8.8,6.75 9.06,7.01 J5.B4A9 | 15.46,16.71 D5.A
  Top 0.406: J5.B4A9 9.06,8.76 v10.01,9.71 | 18.37,12.26 17.41,12.26 Q1.1 17.26,11.56 17.01,11.31 15.45,11.31 13.51,11.31 12.78,12.04 v12.78,12.05 | 15.36,16.61 D5.A | J5.A4B9 4.16,8.77 3.74,9.19 3.74,9.73 3.75,9.74 | R13.2 3.67,9.82 2.1,9.82 J1.1 | R14.2 16.56,14.57
  Top 0.508: D5.A 16.06,16.56 16.51,16.11 16.51,14.62 16.51,14.36 17.18,13.69 17.18,12.49 Q1.1
  Bottom 0.254: v5.14,13.5 5.9,12.74 5.9,10.55 6.74,9.71 v10.01,9.71
  Bottom 0.406: v10.01,9.71 10.01,12.45 10.75,13.19 12.27,13.19 12.78,12.68 v12.78,12.05
CC1
  Top 0.2: R4.2 4.91,9.11 4.86,9.06 J5.B8 J5.A5
CC2  (via drill 0.3)
  Top 0.2: J5.B5 8.36,5.96 v8.01,5.61 | R10.2 11.31,9.11 v11.01,8.81
  Bottom 0.2: v8.01,5.61 8.41,6.01 8.41,8.11 9.11,8.81 v11.01,8.81
D+  (via drill 0.3)
  Top 0.2: 7.38,9.51 R6.1 6.29,9.48 6.26,9.51 | v6.41,6.61 6.36,6.66 J5.A6 6.36,8.91 6.26,9.01 6.26,9.51 | J5.B6 7.36,7.06 7.71,6.71 v7.71,6.51 | 6.26,9.51 6.26,11.76 6.06,11.95 D4.3
  Bottom 0.2: v7.71,6.51 6.51,6.51 v6.41,6.61
D-
  Top 0.2: D4.2 4.97,12.65 5.11,12.51 5.11,11.91 5.86,11.16 J5.B7 5.86,6.92 5.8,6.86 5.8,6.36 6.16,6 6.66,6 7.02,6.36 7.02,6.86 6.86,7.02 J5.A7 6.86,8.71 7.06,8.91 8.51,8.91 8.61,9.01 R7.1
DTR  (via drill 0.3)
  Top 0.2: IC2.28 7.6,13.34 7.21,12.95 v7.21,12.71 | U$3.2 5,16.91 5.39,16.52 5.39,16.24 | v5.39,15.58 5.39,16.24 | U$3.4 6.2,16.24 5.39,16.24
  Bottom 0.2: v7.21,12.71 6.49,12.71 5.79,13.41 5.79,15.18 v5.39,15.58
EN
  Top 0.2: U2.3 18.36,16.46 U3.1 | U3.1 19.84,16.46 20.43,17.05 20.43,17.45 20.87,17.89 R2.1 | R14.1 18.38,15.43 18.58,15.63 U3.1
GND  (via drill 0.3)
  Top 0.2: R10.1 11.28,10.61 10.81,10.61 10.62,10.42 10.62,9.42 9.86,8.66 J5.B1A12 10.71,7.9 10.93,7.69 J5.S2 | IC2.EXP 9.91,14.34 IC2.3 9.91,12.1 9.61,11.79 8.46,11.79 8.34,11.92 8.34,12.71 IC2.M | R4.1 4.91,11.31 4.61,11.61 v3.71,11.61 | C1.2 20.85,20.36 v21.16,20.05 | U$2.GND 4.38,28.64
  Top 0.406: 22.44,11.31 v22.5,11.25
  Top 0.5: U1.2 22.44,11.31
  Top 0.61: v22.5,10.49 22.44,10.55 22.44,11.31
  Top 0.813: 23.89,10.49 v22.5,10.49
  other vias: 16.01,3.11 16.01,0.81 22.81,3.11 22.81,0.81 4.51,2.81 8.71,2.81 0.71,5.21 0.71,3.71 0.71,2.21 24.51,5.51 24.51,3.91 24.51,2.51 24.51,7.21 18.31,13.41 1.51,1.01 2.91,0.71 4.21,0.71 5.61,0.71 7.01,0.71 8.41,0.71 10.01,0.71 11.61,0.71 17.61,0.71 19.41,0.71 21.21,0.71 24.21,1.11 0.71,6.61 19.87,15.72 17.41,16.59 15.7,15.54 20.4,9.13 20.4,8.24 20.4,7.35 11.74,23.09 4.12,50.64 6.41,50.64 8.82,50.64 11.23,50.64 13.77,50.64 16.57,50.64 19.49,50.64 3.74,27.15 4.63,26.39 2.6,49.63 7.68,49.37 10.22,49.37 12.76,49.37 15.3,49.37 17.84,49.37 5.39,49.37 9.54,18.11 10.42,21.8 6.61,24.08 11.74,32.48 9.96,28.17 12.38,18.13 10.85,18.13 19.62,17.37 18.35,23.72 7.55,11.78 16.19,5.81 17.08,29.69 17.58,27.91 12.76,28.42 16.19,13.56 7.42,37.44 11.61,39.21 18.22,35.53 12,42.01 8.06,45.82 6.66,47.22 12.38,46.2 17.71,45.56 19.87,47.34 18.22,40.87 9.2,26.01 21.01,24.36 22.41,22.07
  pour Bottom: -0.4,51.31 -0.4,-0.29 25.51,-0.29 25.51,51.31
  pour Top: -0.59,51.41 25.71,51.41 25.71,-0.39 -0.59,-0.39
N$1
  Top 0.2: R8.1 IC2.9
N$2
  Top 0.2: D1.C 1.46,51.31 0.97,50.82 R3.2
N$3
  Top 0.2: D2.C 23.93,51.23 24.35,50.82 R5.2
N$5
  Top 0.2: IC2.4 10.41,11.46 9.98,11.04 7.74,11.04 7.41,10.71 R6.2
N$6
  Top 0.2: R7.2 9.79,10.34 10.91,11.46 IC2.5
N$7
  Top 0.2: D3.A 12.61,5.29 12.61,5.91 12.51,6.01 R9.2
N$8
  Top 0.305: U1.5 19.86,10.36 20.4,10.9 20.4,13.37 R11.2
N$9
  Top 0.2: D6.A R12.1
N$10
  Bottom 0.2: U4.5 U4.2 U4.3 8.19,31.76 7.96,31.99 7.96,33.64 8.26,33.94 R18.2
N$11  (via drill 0.3)
  Top 0.2: D6.C 14.11,4.01 14.51,4.41 v15.41,4.41 | U1.1 21.42,10.25 21.42,9.76 22.67,8.51 v22.81,8.51
  Bottom 0.2: v15.41,4.41 16.01,4.41 16.61,3.81 22.31,3.81 22.81,4.31 v22.81,8.51
N$12
  Bottom 0.2: U$1.7 7.58,43.29 7.19,43.67 7.19,46.72 7.58,47.1 R15.2
N$13  (via drill 0.3)
  Top 0.2: v10.12,29.57 10.12,33.38 10.62,33.89 v11.77,33.89
  Bottom 0.2: 12.94,33.94 Q2.1 11.85,33.98 v11.77,33.89 11.72,33.94 R17.2 | U4.6 10.34,30.44 10.12,30.21 v10.12,29.57
N$15
  Bottom 0.2: U$1.3 17.99,42.02 18.5,42.53 18.5,46.59 17.95,47.14 R16.1
RES  (via drill 0.3)
  Top 0.2: J1.7 1.21,26.8 2.4,28 2.4,30.04 2.75,30.39 2.75,32.43 3.11,32.78 3.11,33.49 3.39,33.77 U$2.RES 6.59,33.77 8.24,32.12 8.24,27.14 8.59,26.78 v9.86,26.78 | RST.4 v13.41,23.87 v13.42,23.86 v13.41,23.85 RST.3 13.42,20.81 12.58,19.97 J3.10 9.32,19.03 8.84,18.55 8.11,18.55 7.12,17.56 U$3.6
  Bottom 0.2: 13.42,23.99 v13.42,23.86
  Bottom 0.254: v9.86,26.78 12.78,26.78 13.42,26.14 13.42,23.99
RTS
  Top 0.2: U$3.1 4.91,17.56 5.56,16.91 U$3.5 7.01,16.91 7.45,16.47 7.45,15.6 7.71,15.34 IC2.24
TCK  (via drill 0.3)
  Top 0.2: J3.4 8.29,23.78 8.08,23.99 8.08,24.76 7.48,25.36 7.48,30.72 6.97,31.23 v5.8,31.23 v5.8,31.22 v5.79,31.23 U$2.TCKC
  Bottom 0.2: J1.5 2.4,22.06 2.4,24.1 2.85,24.55 2.85,30.72 3.36,31.22 v5.8,31.22
TDI
  Top 0.2: 5.8,21.19 5.8,22.72 6.18,23.1 10.39,23.1 10.62,23.33 10.62,29.07 13.16,31.61 19.01,31.61 19.9,32.5 U$2.DIO17 | J3.8 9.27,21.19 5.8,21.19 | J1.3 2.66,17.24 2.66,18.56 3.36,19.26 5.42,19.26 5.8,19.64 5.8,21.19
TDO  (via drill 0.3)
  Top 0.2: U$2.DIO16 13.42,31.23 10.98,28.78 10.98,22.94 10.5,22.46 9.37,22.46 J3.6 9.27,22.46 v6.56,22.46
  Bottom 0.2: J1.4 2.4,19.52 2.4,21.48 3.38,22.46 v6.56,22.46
TMS  (via drill 0.3)
  Top 0.2: J3.2 8.29,25.05 7.83,25.51 7.83,31.61 6.94,32.5 v5.8,32.5 v5.8,32.49 v5.79,32.5 U$2.TMSC
  Bottom 0.2: J1.6 2.5,24.7 2.5,30.97 3.13,31.61 4.91,31.61 v5.8,32.49
UVCC
  Top 0.2: U2.1 16.48,17.69
  Top 0.32: U2.1 16.46,18.85 16.81,19.2 18.62,19.2 19.16,18.66 C1.1
  Top 0.406: 15.36,14.21 D5.C 15.31,14.9 14.9,15.31 14.61,15.31 14.21,15.71 14.21,17.21 14.71,17.71 U2.1 | U2.1
  Top 0.61: Q1.2 15.36,14.21
V+  (via drill 0.3)
  Top 0.2: 12.71,9.76 C4.1 | R9.1 12.51,8.6 12.66,8.75 12.66,9.76 12.66,9.93
  Top 0.254: C4.1 12.66,9.93 12.71,9.88
  Top 0.305: C2.1 14.91,20.31 | IC2.6 IC2.7 11.91,11.9 12.4,11.41 v12.4,11.03 12.66,10.77 12.66,9.76
  Top 0.406: C2.1 16.41,20.36 U2.5
  Top 0.508: U2.5 16.58,20.43 v17.35,20.43
  Bottom 0.2: U4.4 13.91,31.76 Q2.3
  Bottom 0.508: v12.4,11.03 13.29,11.03 13.67,11.41 13.67,19.54 14.43,20.3 17.23,20.3 v17.35,20.43 17.35,26.02 13.93,29.45 Q2.3 15.37,31.78 15.83,32.24 SJ1.1
VCC  (via drill 0.3)
  Top 0.076: 23.29,12.15 21.33,12.15 21.33,15.45 21.33,15.56 21.33,15.72 22.31,15.72 24.25,13.78 24.25,13.11 23.29,12.15
  Top 0.2: CN1.1 18.21,7.01 | 20.87,15.42 U3.3 | R2.2 | 21.65,15.51 21.67,15.49 | R2.2 21.33,15.56 | 21.33,15.45 21.27,15.51 21.33,15.57 R2.2 | CN1.1 18.12,7.21 | CN1.1 18.41,7.33 v18.43,7.35
  Top 0.406: U3.3 21.27,15.51 21.65,15.51 | 21.67,15.49 22.33,15.49 24.11,13.71 | 23.12,12.26 J2.2
  Top 0.508: U1.3 v22.45,12.26 | v22.45,12.26 v22.46,12.27 | v22.45,12.26 23.12,12.26
  Top 0.61: 18.12,7.21 16.91,7.21 16.31,7.81 v16.31,8.51 Q1.3
  Bottom 0.2: PAD2.1 v18.43,8.24 | PAD2.1 18.43,8.4 v18.43,9.13 | PAD2.1 18.43,8.08 v18.43,7.35
  Bottom 0.305: v22.67,13.83 v22.67,14.61 | v22.66,14.62 v22.67,14.61 | v22.67,14.61 v21.92,14.61 21.95,14.58 v21.95,13.86 21.97,13.84 21.97,13.83 | v22.67,14.61 22.7,14.58 | 21.97,13.83 v22.67,13.83 | 21.97,13.83 v21.97,13.07 v21.98,13.06 v22.68,13.06 v22.67,13.07 22.67,13.44 v22.67,13.83 | v22.66,14.62 22.63,14.59 22.63,13.03 21.85,13.03 21.84,13.04 21.84,14.69 22.59,14.69 v22.66,14.62
  Bottom 0.813: v16.31,8.51 16.31,11.31 17.27,12.27 22.05,12.27 | 22.05,12.27 v22.46,12.27 23.44,13.25 J2.2 | 22.05,12.27 21.92,12.4 v21.92,14.61 22,14.69 22.59,14.69 | v22.66,14.62 24.03,13.25 J2.2 | J2.2 22.86,13.25 22.67,13.44
  pour Top: 21.39,15.7 21.39,12.1 23.18,12.1 24.25,13.17 24.25,13.7 22.25,15.7
  pour Top (no thermals): 23.12,12.12 21.4,12.12 21.4,15.71 22.24,15.71 24.25,13.7 24.25,13.25
  pour Bottom: 21.84,14.69 21.84,13.03 22.71,13.03 22.74,13.06 22.74,14.62 22.67,14.69

### Text on the board
tNames: R | G | 5 | 27 | 6 | 26 | 7 | 25 | 8 | 24 | 9 | 23 | 10 | 22 | 11 | 21 | 12 | 20 | 13 | JLCJLCJLCJLC | 19 | . | RST | 18 | 15 | TMS | JTAG | TCK | 14 | TDO | 3V3 | TDI | GND | 3V3 | BAT | 5V | GND | PWR | CHG
bNames: DIO5 | DIO27 | DIO6 | DIO26 | DIO7 | DIO25 | DIO8 | DIO24 | DIO9 | DIO23 | DIO10 | DIO22 | DIO11 | DIO21 | DIO21 | DIO12 | DIO20 | DIO13 | DIO19 | RST | DIO18 | TMS | DIO15 | TCK | DIO14 | DIO16/TDO | 3V3 | DIO17/TDI | GND | 3V3 | BAT | 5V | GND | + | - | t.me/deaxx